# Altium schematic sheet Connectors.SchDoc
size A4
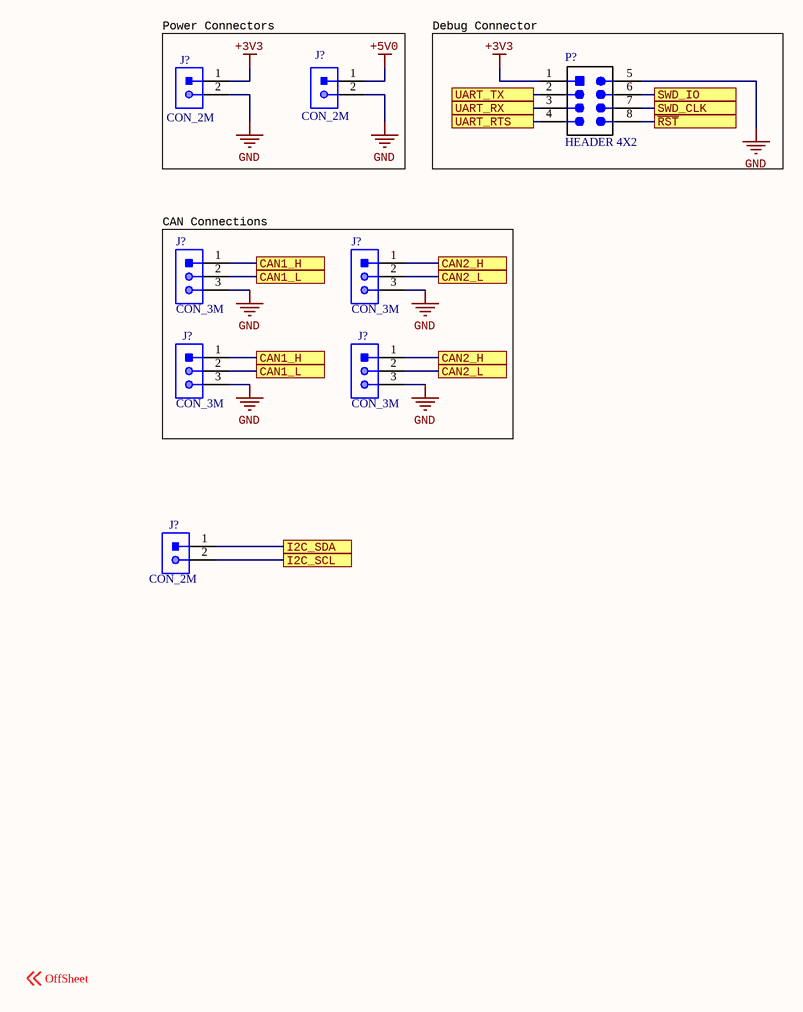
[diagram p0: Connectors.SchDoc]

## Parts
(Parts that share a designator on the sheet are numbered #1, #2 ... from top to bottom, then left to right.)
J?#1  CON_2M  [JST-B2B-PHSK]
J?#2  CON_2M  [JST-B2B-PHSK]
J?#3  CON_3M  [JST-B3B-SM4-TB]
J?#4  CON_3M  [JST-B3B-SM4-TB]
J?#5  CON_3M  [JST-B3B-SM4-TB]
J?#6  CON_3M  [JST-B3B-SM4-TB]
J?#7  CON_2M  [JST-B2B-PHSK]
P?  HEADER 4X2  [HEADER_2X4]

## Blocks framed on the sheet
Power Connectors: J?#1 J?#2
Debug Connector: P?
CAN Connections: J?#3-J?#6

## Ports
CAN1_H, CAN1_L, CAN2_H, CAN2_L, I2C_SCL, I2C_SDA, SWD_CLK, SWD_IO, UART_RTS, UART_RX, UART_TX, ~{RST}

## Nets
+3V3: J?#1.1 P?.1(VCC)
+5V0: J?#2.1
GND: J?#1.2 J?#2.2 J?#3.3 J?#4.3 J?#5.3 J?#6.3 P?.5(GND)
~{RST}: P?.8 ; port ~{RST}
CAN1_H: J?#3.1 J?#5.1 ; port CAN1_H
CAN1_L: J?#3.2 J?#5.2 ; port CAN1_L
CAN2_H: J?#4.1 J?#6.1 ; port CAN2_H
CAN2_L: J?#4.2 J?#6.2 ; port CAN2_L
I2C_SCL: J?#7.2 ; port I2C_SCL
I2C_SDA: J?#7.1 ; port I2C_SDA
SWD_CLK: P?.7 ; port SWD_CLK
SWD_IO: P?.6 ; port SWD_IO
UART_RTS: P?.4 ; port UART_RTS
UART_RX: P?.3 ; port UART_RX
UART_TX: P?.2 ; port UART_TX

## Notes on the sheet
- Labels drawn without touching a wire or pin: OffSheet

## Library data of the parts
P? = HEADER 4X2: Header, 4-Pin Dual row; MPN: GRPB042VWVN-RC; Manufacturer: Sullins Connector Solutions; Digikey Part Number: S9015E-04-ND